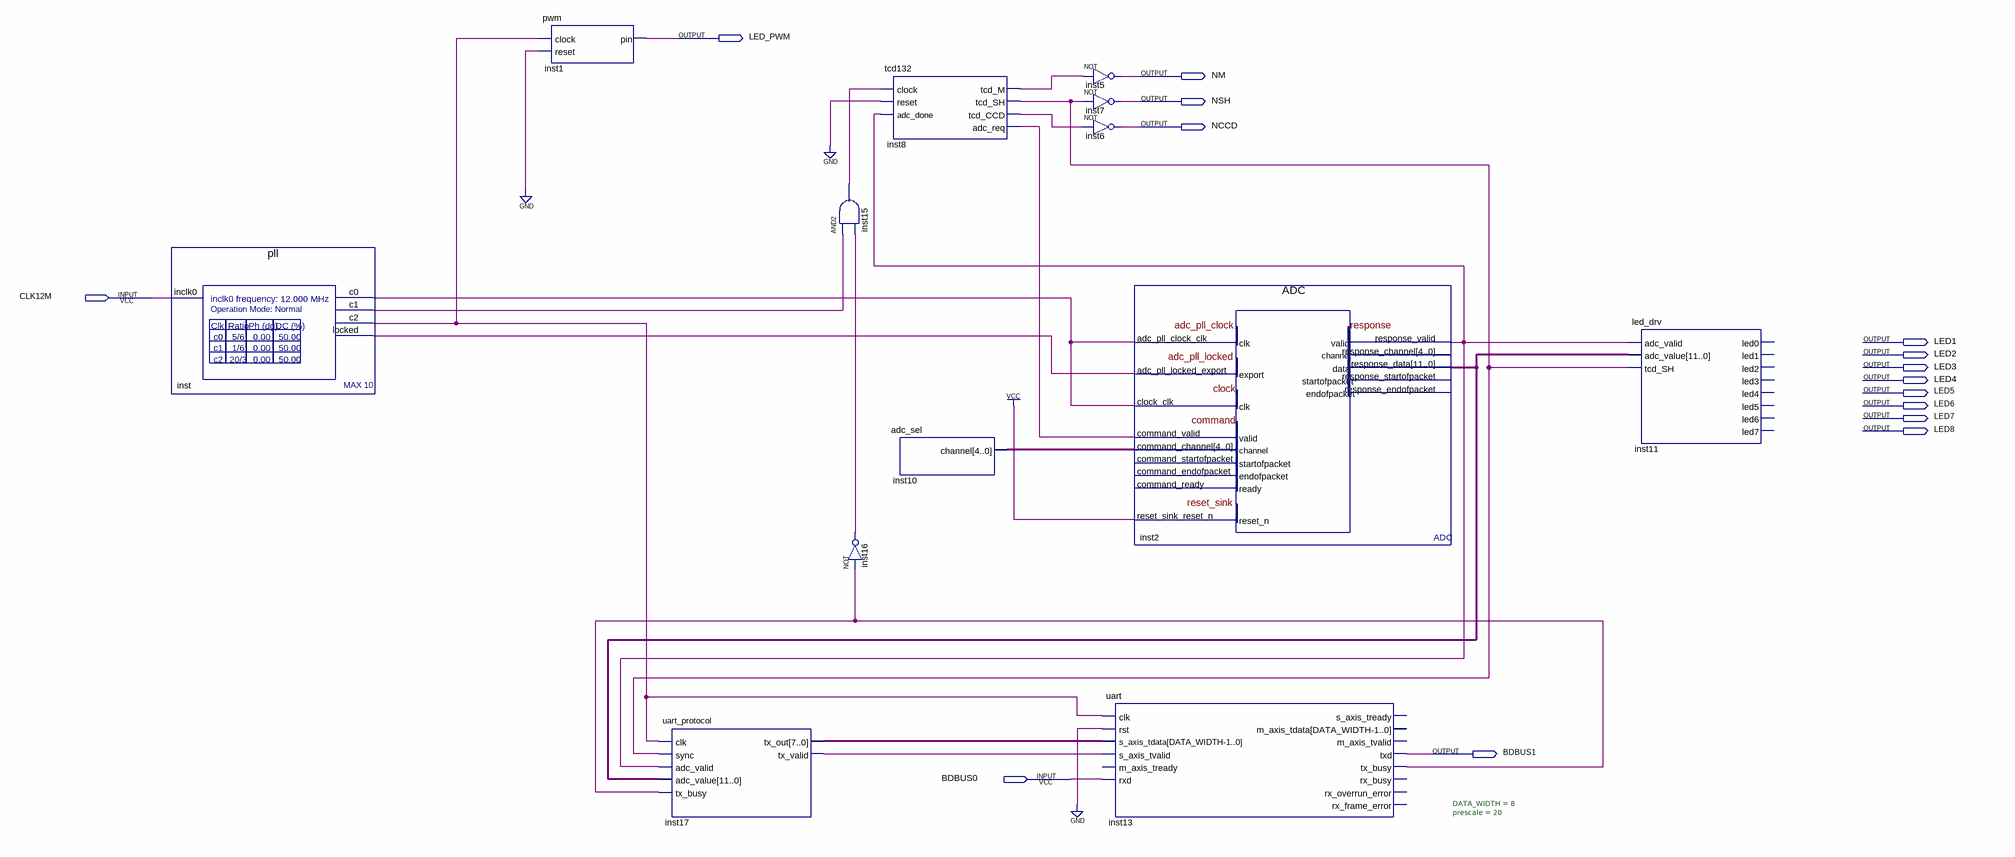
[diagram p0: schematic sheet]
// Quartus schematic FilamentSensor.bdf as structural Verilog: 13 symbols, 15 pins
module FilamentSensor (
  input  CLK12M,
  input  BDBUS0,
  output LED_PWM,
  output NM,
  output NSH,
  output NCCD,
  output LED1,
  output LED2,
  output LED3,
  output LED4,
  output LED5,
  output LED6,
  output LED7,
  output LED8,
  output BDBUS1
);

  wire inst2_response_valid, inst8_adc_req, inst8_tcd_ccd, inst8_tcd_m, inst8_tcd_sh, inst13_tx_busy,
       inst15_out, inst16_out, inst17_tx_valid, inst_c0, inst_c1, inst_c2, inst_locked;
  wire [4:0] inst10_channel;
  wire [7:0] inst17_tx_out;
  wire [11:0] inst2_response_data;

  pll inst (.inclk0(CLK12M), .c0(inst_c0), .c1(inst_c1), .c2(inst_c2), .locked(inst_locked));
  pwm inst1 (.clock(inst_c2), .reset(1'b0), .pin(LED_PWM));
  uart_protocol inst17 (
    .clk(inst_c2), .sync(inst8_tcd_sh), .adc_valid(inst2_response_valid), .adc_value(inst2_response_data),
    .tx_busy(inst13_tx_busy), .tx_out(inst17_tx_out), .tx_valid(inst17_tx_valid));
  and inst15 (inst15_out, inst_c1, inst16_out);
  not inst16 (inst16_out, inst13_tx_busy);
  tcd132 inst8 (
    .clock(inst15_out), .reset(1'b0), .adc_done(inst2_response_valid), .tcd_M(inst8_tcd_m),
    .tcd_SH(inst8_tcd_sh), .tcd_CCD(inst8_tcd_ccd), .adc_req(inst8_adc_req));
  adc_sel inst10 (.channel(inst10_channel));
  not inst5 (NM, inst8_tcd_m);
  not inst7 (NSH, inst8_tcd_sh);
  not inst6 (NCCD, inst8_tcd_ccd);
  uart #(.DATA_WIDTH(8), .prescale(20)) inst13 (
    .clk(inst_c2), .rst(1'b0), .s_axis_tdata(inst17_tx_out), .s_axis_tvalid(inst17_tx_valid), .rxd(BDBUS0),
    .txd(BDBUS1), .tx_busy(inst13_tx_busy));  // open: m_axis_tready, s_axis_tready, m_axis_tdata, m_axis_tvalid, rx_busy, rx_overrun_error, rx_frame_error
  ADC inst2 (
    .adc_pll_clock_clk(inst_c0), .adc_pll_locked_export(inst_locked), .clock_clk(inst_c0),
    .command_valid(inst8_adc_req), .command_channel(inst10_channel), .reset_sink_reset_n(1'b1),
    .response_valid(inst2_response_valid), .response_data(inst2_response_data));  // open: command_startofpacket, command_endofpacket, command_ready, response_channel, response_startofpacket, response_endofpacket
  led_drv inst11 (
    .adc_valid(inst2_response_valid), .adc_value(inst2_response_data), .tcd_SH(inst8_tcd_sh));  // open: led0, led1, led2, led3, led4, led5, led6, led7
endmodule
